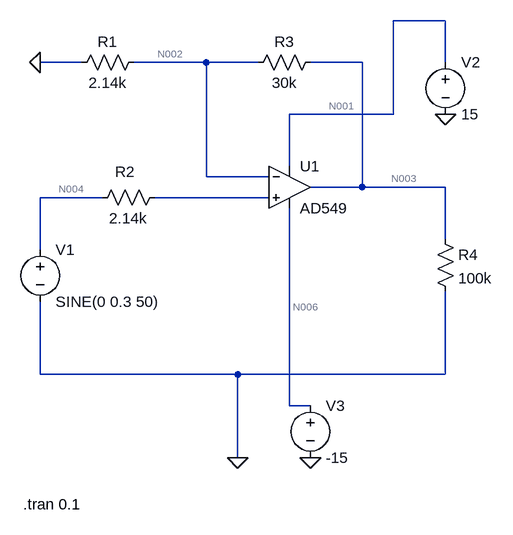
[diagram p0: schematic Draft1.asc]
Draft1.asc, the LTspice schematic file:
Version 4
SHEET 1 880 680
WIRE 688 -240 608 -240
WIRE 128 -176 64 -176
WIRE 320 -176 208 -176
WIRE 400 -176 320 -176
WIRE 560 -176 480 -176
WIRE 688 -176 688 -240
WIRE 608 -96 608 -240
WIRE 608 -96 448 -96
WIRE 448 -16 448 -96
WIRE 320 0 320 -176
WIRE 416 0 320 0
WIRE 560 16 560 -176
WIRE 560 16 480 16
WIRE 688 16 560 16
WIRE 160 32 64 32
WIRE 416 32 240 32
WIRE 688 96 688 16
WIRE 64 112 64 32
WIRE 64 304 64 192
WIRE 368 304 64 304
WIRE 688 304 688 176
WIRE 688 304 368 304
WIRE 448 352 448 48
WIRE 480 352 448 352
WIRE 368 432 368 304
FLAG 480 432 0
FLAG 368 432 0
FLAG 688 -96 0
FLAG 64 -176 0
SYMBOL voltage 64 96 R0
WINDOW 123 0 0 Left 0
WINDOW 39 0 0 Left 0
SYMATTR InstName V1
SYMATTR Value SINE(0 0.3 50)
SYMBOL res 256 16 R90
WINDOW 0 -8 61 VBottom 2
WINDOW 3 32 56 VTop 2
SYMATTR InstName R2
SYMATTR Value 2.14k
SYMBOL OpAmps\\AD549 448 -48 R0
SYMATTR InstName U1
SYMBOL res 496 -192 R90
WINDOW 0 0 56 VBottom 2
WINDOW 3 32 56 VTop 2
SYMATTR InstName R3
SYMATTR Value 30k
SYMBOL voltage 688 -192 R0
WINDOW 123 0 0 Left 0
WINDOW 39 0 0 Left 0
SYMATTR InstName V2
SYMATTR Value 15
SYMBOL res 672 80 R0
SYMATTR InstName R4
SYMATTR Value 100k
SYMBOL voltage 480 336 R0
WINDOW 123 0 0 Left 0
WINDOW 39 0 0 Left 0
SYMATTR InstName V3
SYMATTR Value -15
SYMBOL res 224 -192 R90
WINDOW 0 0 56 VBottom 2
WINDOW 3 32 56 VTop 2
SYMATTR InstName R1
SYMATTR Value 2.14k
TEXT 38 504 Left 2 !.tran 0.1

The netlist it stands for:
* Draft1.asc
V1 N004 0 SINE(0 0.3 50)
R2 N005 N004 2.14k
XU1 N005 N002 N001 N006 N003 AD549  ; pins In+ In- V+ V- OUT
R3 N003 N002 30k
V2 N001 0 15
R4 N003 0 100k
V3 N006 0 -15
R1 N002 0 2.14k
.tran 0.1
.backanno
.end

* Results of the author's LTspice run, read from the files saved beside the schematic
* Operating Point, zero values left out:
*   V(n002) = -359 nV
*   V(n001) = 15 V
*   V(n003) = -5.391 µV
*   V(n006) = -15 V
*   I(R1) = -167.7 pA
*   I(R4) = -53.91 pA
*   I(R3) = -167.7 pA
*   I(V3) = 794.4 µA
*   I(V2) = -794.4 µA
*   Ix(u1:3) = 794.4 µA
*   Ix(u1:4) = -794.4 µA
*   Ix(u1:5) = 221.6 pA
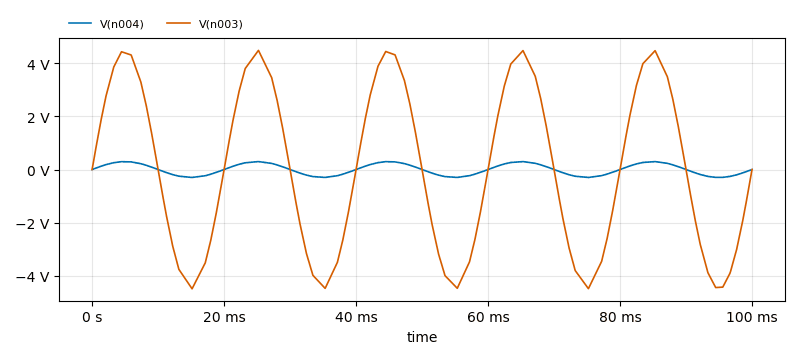
[diagram p1: Transient Analysis of Draft1.asc, plotted from the saved traces]
* Transient Analysis, 1 run:
*   V(n004): min -299.4 mV, max 299.1 mV, average 126.5 µV, rms 209.2 mV, last 0 V
*   V(n003): min -4.495 V, max 4.491 V, average 1.894 mV, rms 3.141 V, last -3.289 mV